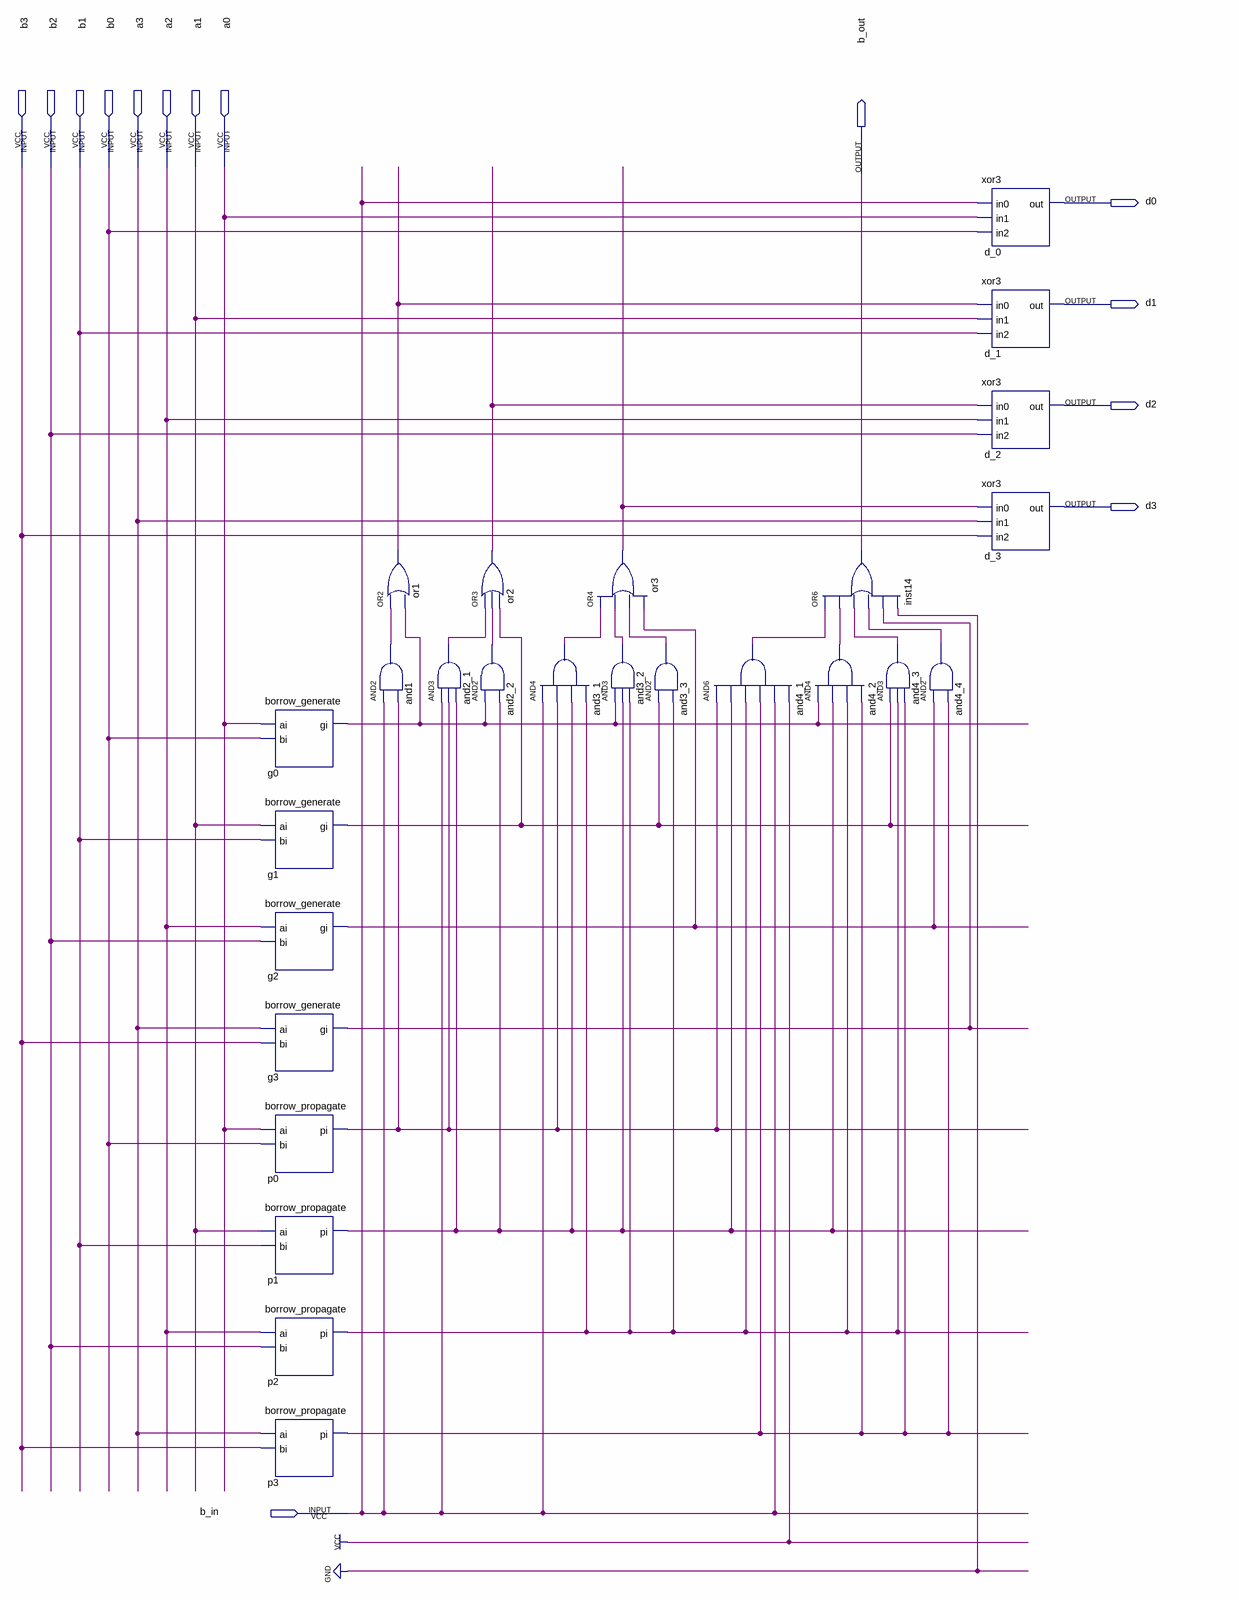
[diagram p0: schematic sheet]
// Quartus schematic First.bdf as structural Verilog: 26 symbols, 14 pins
module First (
  input  b3,
  input  b2,
  input  b1,
  input  b0,
  input  a3,
  input  a2,
  input  a1,
  input  a0,
  input  b_in,
  output b_out,
  output d0,
  output d1,
  output d2,
  output d3
);

  wire and1_out, and2_1_out, and2_2_out, and3_1_out, and3_2_out, and3_3_out, and4_1_out, and4_2_out,
       and4_3_out, and4_4_out, g0_gi, g1_gi, g2_gi, g3_gi, or1_out, or2_out, or3_out, p0_pi, p1_pi, p2_pi,
       p3_pi;

  borrow_generate g0 (.ai(a0), .bi(b0), .gi(g0_gi));
  borrow_generate g1 (.ai(a1), .bi(b1), .gi(g1_gi));
  borrow_generate g2 (.ai(a2), .bi(b2), .gi(g2_gi));
  borrow_generate g3 (.ai(a3), .bi(b3), .gi(g3_gi));
  borrow_propagate p0 (.ai(a0), .bi(b0), .pi(p0_pi));
  borrow_propagate p1 (.ai(a1), .bi(b1), .pi(p1_pi));
  borrow_propagate p2 (.ai(a2), .bi(b2), .pi(p2_pi));
  borrow_propagate p3 (.ai(a3), .bi(b3), .pi(p3_pi));
  or or1 (or1_out, and1_out, g0_gi);
  and and1 (and1_out, b_in, p0_pi);
  and and2_1 (and2_1_out, b_in, p0_pi, p1_pi);
  or or2 (or2_out, and2_1_out, and2_2_out, g1_gi);
  and and2_2 (and2_2_out, g0_gi, p1_pi);
  and and3_1 (and3_1_out, b_in, p0_pi, p1_pi, p2_pi);
  or or3 (or3_out, and3_1_out, and3_2_out, and3_3_out, g2_gi);
  and and3_2 (and3_2_out, g0_gi, p1_pi, p2_pi);
  and and3_3 (and3_3_out, g1_gi, p2_pi);
  and and4_1 (and4_1_out, p0_pi, p1_pi, p2_pi, p3_pi, b_in, 1'b1);
  and and4_2 (and4_2_out, g0_gi, p1_pi, p2_pi, p3_pi);
  or inst14 (b_out, and4_1_out, and4_2_out, and4_3_out, and4_4_out, g3_gi, 1'b0);
  and and4_3 (and4_3_out, g1_gi, p2_pi, p3_pi);
  and and4_4 (and4_4_out, g2_gi, p3_pi);
  xor3 d_0 (.in0(b_in), .in1(a0), .in2(b0), .out(d0));
  xor3 d_1 (.in0(or1_out), .in1(a1), .in2(b1), .out(d1));
  xor3 d_2 (.in0(or2_out), .in1(a2), .in2(b2), .out(d2));
  xor3 d_3 (.in0(or3_out), .in1(a3), .in2(b3), .out(d3));
endmodule
